# Altium schematic sheet power.SchDoc
size A4
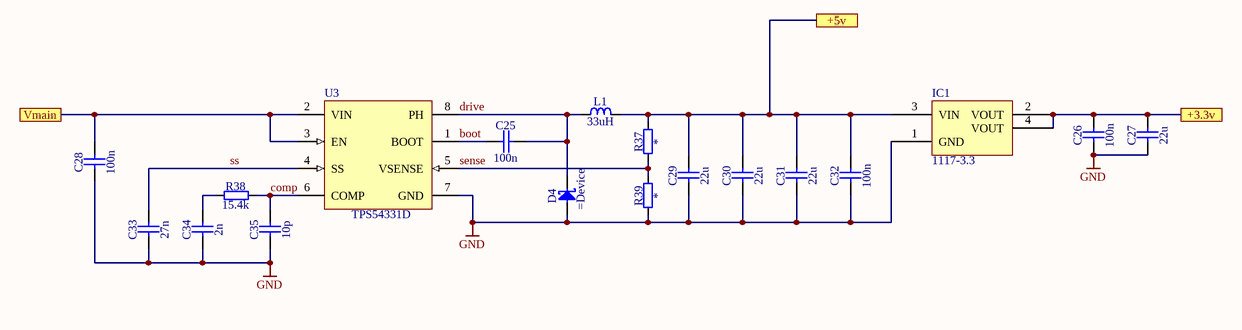
[diagram p0: power.SchDoc]

## Parts
C25  100n  [CAPC1608X87N]
C26  100n  [CAPC1608X87N]
C27  22u  [CAPC3216X140N]
C28  100n  [CAPC1608X87N]
C29  22u  [CAPC3216X140N]
C30  22u  [CAPC3216X140N]
C31  22u  [CAPC3216X140N]
C32  100n  [CAPC1608X87N]
C33  27n  [CAPC1608X87N]
C34  2n  [CAPC1608X87N]
C35  10p  [CAPC1608X87N]
D4  (no value)  [DIOM7659X265N]
IC1  1117-3.3  [SOT230P700X180-4N]
L1  33uH  [IND_WURTH_WE-PD_7332(METAL)]
R37  *  [RESC1608X55N]
R38  15.4k  [RESC1608X55N]
R39  *  [RESC1608X55N]
U3  TPS54331D  [SOIC127P600X175-8N]

## Ports
+3.3v, +5v, Vmain

## Nets
GND: C26.1 C27.1 C28.1 C29.1 C30.1 C31.1 C32.1 C33.1 C34.1 C35.1 D4.2(A) IC1.1(GND) R39.1 U3.7(GND)
+3.3v: C26.2 C27.2 IC1.2(VOUT) IC1.4(VOUT) ; port +3.3v
+5v: C29.2 C30.2 C31.2 C32.2 IC1.3(VIN) L1.2 R37.2 ; port +5v
boot: C25.1 U3.1(BOOT)
comp: C35.2 R38.2 U3.6(COMP)
drive: C25.2 D4.1(C) L1.1 U3.8(PH)
sense: R37.1 R39.2 U3.5(VSENSE)
ss: C33.2 U3.4(SS)
Vmain: C28.2 U3.2(VIN) U3.3(EN) ; port Vmain
NetC34_2: C34.2 R38.1

## Library data of the parts
C25-C35 = Capacitor - non polarized: Non-polarised capacitor
  C25 C26 C28 C32: Value: 100n
  C27 C29-C31: Value: 22u
  C33: Value: 27n
  C34: Value: 2n
  C35: Value: 10p
D4 = Diode Schottky: Schottky Diode
IC1 = ON Semi NCP1117: 1.0A Low-Dropout Positive Fixed and Adjustable Voltage Regulators
L1 = Inductor: Device: HPI0630-330; Value: 33uH
R37-R39 = Resistor
  R37 R39: Value: *
  R38: Value: 15.4k
U3 = TPS54331D: Buck Step Down Regulator with 3.5 to 28 V Input and 0.8 to 25 V Output, -40 to 150 degC, 8-Pin SOIC (D), Green (RoHS & no Sb/Br); Manufacturer: Texas Instruments; Vout(Min)(V): 0.8; Vin(Min)(V): 3.5; Duty Cycle(Max)(%): 90; SubFamily: Step-Down Regulator; Iq(Typ)(mA): 0.11; Vin(Max)(V): 28; Rating: Catalog; Vout(Max)(V): 25; Iout(Max)(A): 3; Regulated Outputs(#): 1; PackageReference: D8; Switch Current Limit(Typ)(A): 3.5; Topology: Buck; Eco-Plan: Green (RoHS & no Sb/Br); PartNumber: TPS54331D; ComponentLink1Description: Datasheet; ComponentLink2Description: Package Specification; DatasheetVersion: SLVS839D; ComponentLink3URL: Samples URL:http://www.ti.com/product/tps54331#samples; ComponentLink1URL: http://www.ti.com/general/docs/lit/getliterature.tsp?genericPartNumber=TPS54331&fileType=pdf; Code_JEDEC: MS-012AA; ComponentLink2URL: http://www.ti.com/litv/pdf/msoi002j; ComponentLink3Description: URL Link1; PackageVersion: revM, Jun-2011; Mounting Technology: Surface Mount; PackageDescription: 8-Pin Plastic Small Outline Integrated Circuit, 4.9 x 3.9 mm, Pitch 1.27 mm Pitch